# Altium schematic sheet PCB.SchDoc
size A4
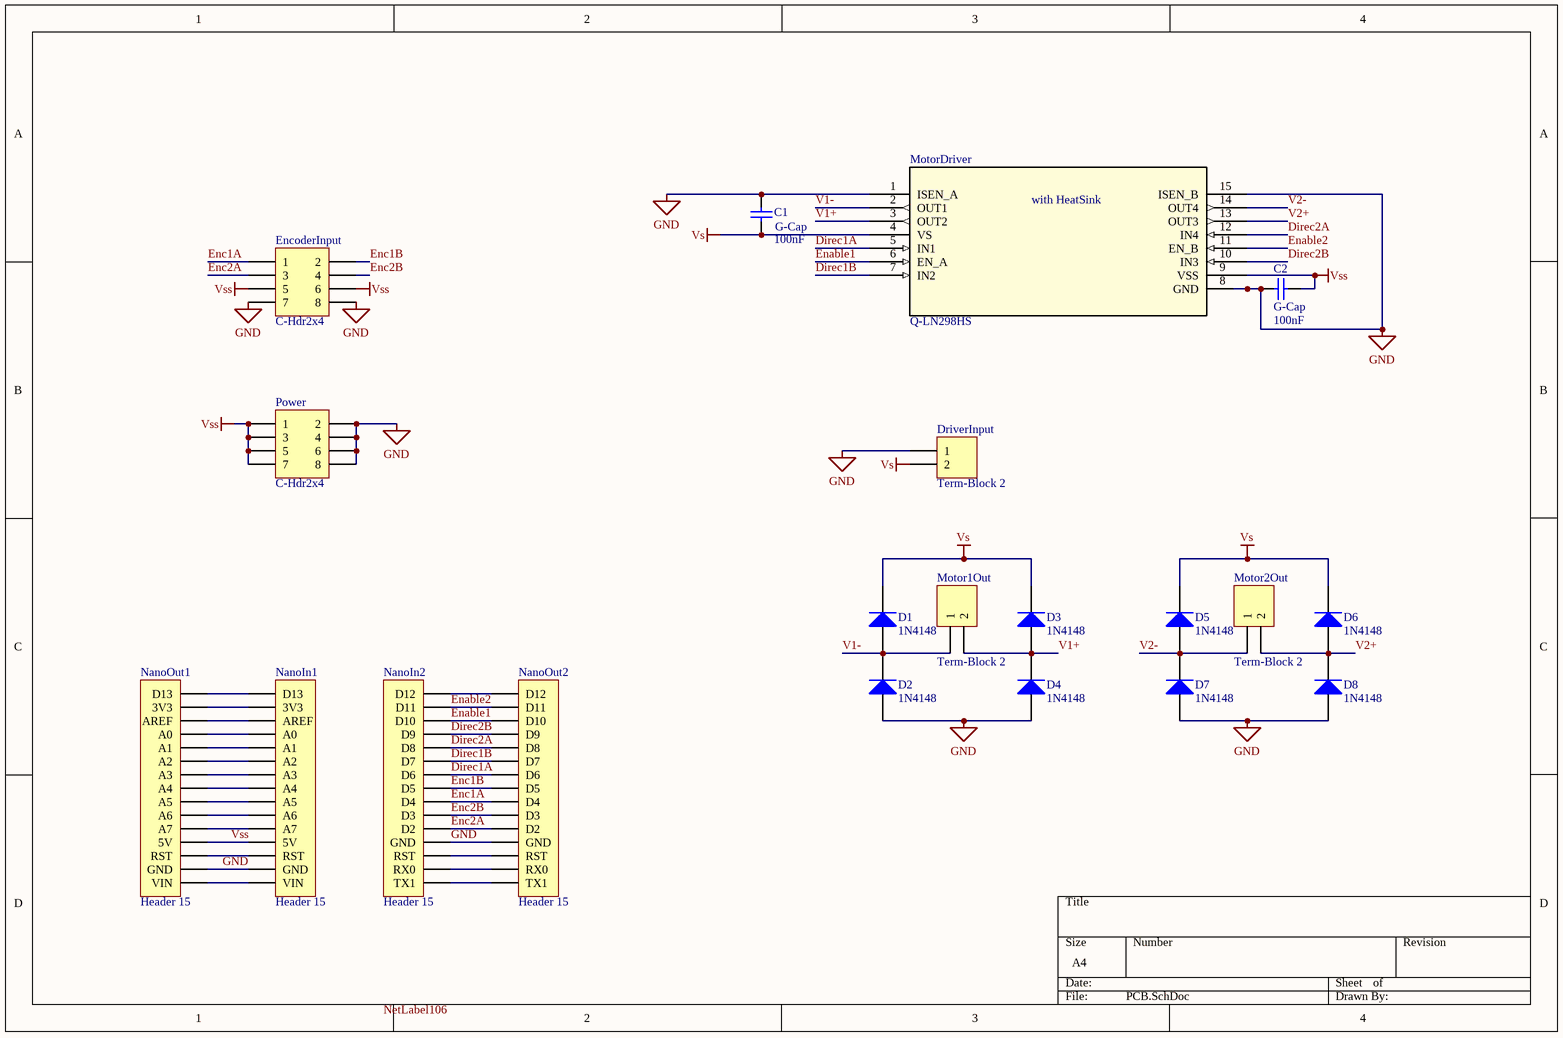
[diagram p0: PCB.SchDoc]

## Parts
C1  G-Cap  value 100nF  [Cap2.54mm_LGE1.0]
C2  G-Cap  value 100nF  [Cap2.54mm_LGE1.0]
D1  1N4148  [DO-41_XLGE1.2]
D2  1N4148  [DO-41_XLGE1.2]
D3  1N4148  [DO-41_XLGE1.2]
D4  1N4148  [DO-41_XLGE1.2]
D5  1N4148  [DO-41_XLGE1.2]
D6  1N4148  [DO-41_XLGE1.2]
D7  1N4148  [DO-41_XLGE1.2]
D8  1N4148  [DO-41_XLGE1.2]
DriverInput  Term-Block 2  [TERM-BLOCK-5.08MM-2POS]
EncoderInput  C-Hdr2x4  [HDR2X4_LGE1.0]
Motor1Out  Term-Block 2  [TERM-BLOCK-5.08MM-2POS]
Motor2Out  Term-Block 2  [TERM-BLOCK-5.08MM-2POS]
MotorDriver  Q-LN298HS  [Multiwatt15_V_ELEC391HS]
NanoIn1  Header 15  [HDR1X15]
NanoIn2  Header 15  [HDR1X15]
NanoOut1  Header 15  [HDR1X15]
NanoOut2  Header 15  [HDR1X15]
Power  C-Hdr2x4  [HDR2X4_LGE1.0]

## Nets
GND: C1.2 C2.1 D2.1(A) D4.1(A) D7.1(A) D8.1(A) DriverInput.1 EncoderInput.7 EncoderInput.8 MotorDriver.1(ISEN_A) MotorDriver.8(GND) MotorDriver.15(ISEN_B) NanoIn1.14(GND) NanoIn2.12(GND) NanoOut1.14(GND) NanoOut2.12(GND) Power.2 Power.4 Power.6 Power.8
Vs: C1.1 D1.2(K) D3.2(K) D5.2(K) D6.2(K) DriverInput.2 MotorDriver.4(VS)
Vss: C2.2 EncoderInput.5 EncoderInput.6 MotorDriver.9(VSS) NanoIn1.12(5V) NanoOut1.12(5V) Power.1 Power.3 Power.5 Power.7
Direc1A: MotorDriver.5(IN1) NanoIn2.7(D6) NanoOut2.7(D6)
Direc1B: MotorDriver.7(IN2) NanoIn2.6(D7) NanoOut2.6(D7)
Direc2A: MotorDriver.12(IN4) NanoIn2.5(D8) NanoOut2.5(D8)
Direc2B: MotorDriver.10(IN3) NanoIn2.4(D9) NanoOut2.4(D9)
Enable1: MotorDriver.6(EN_A) NanoIn2.3(D10) NanoOut2.3(D10)
Enable2: MotorDriver.11(EN_B) NanoIn2.2(D11) NanoOut2.2(D11)
Enc1A: EncoderInput.1 NanoIn2.9(D4) NanoOut2.9(D4)
Enc1B: EncoderInput.2 NanoIn2.8(D5) NanoOut2.8(D5)
Enc2A: EncoderInput.3 NanoIn2.11(D2) NanoOut2.11(D2)
Enc2B: EncoderInput.4 NanoIn2.10(D3) NanoOut2.10(D3)
V1+: D3.1(A) D4.2(K) Motor1Out.2 MotorDriver.3(OUT2)
V1-: D1.1(A) D2.2(K) Motor1Out.1 MotorDriver.2(OUT1)
V2+: D6.1(A) D8.2(K) Motor2Out.2 MotorDriver.13(OUT3)
V2-: D5.1(A) D7.2(K) Motor2Out.1 MotorDriver.14(OUT4)
NetNanoIn1_1: NanoIn1.1(D13) NanoOut1.1(D13)
NetNanoIn1_2: NanoIn1.2(3V3) NanoOut1.2(3V3)
NetNanoIn1_3: NanoIn1.3(AREF) NanoOut1.3(AREF)
NetNanoIn1_4: NanoIn1.4(A0) NanoOut1.4(A0)
NetNanoIn1_5: NanoIn1.5(A1) NanoOut1.5(A1)
NetNanoIn1_6: NanoIn1.6(A2) NanoOut1.6(A2)
NetNanoIn1_7: NanoIn1.7(A3) NanoOut1.7(A3)
NetNanoIn1_8: NanoIn1.8(A4) NanoOut1.8(A4)
NetNanoIn1_9: NanoIn1.9(A5) NanoOut1.9(A5)
NetNanoIn1_10: NanoIn1.10(A6) NanoOut1.10(A6)
NetNanoIn1_11: NanoIn1.11(A7) NanoOut1.11(A7)
NetNanoIn1_13: NanoIn1.13(RST) NanoOut1.13(RST)
NetNanoIn1_15: NanoIn1.15(VIN) NanoOut1.15(VIN)
NetNanoIn2_1: NanoIn2.1(D12) NanoOut2.1(D12)
NetNanoIn2_13: NanoIn2.13(RST) NanoOut2.13(RST)
NetNanoIn2_14: NanoIn2.14(RX0) NanoOut2.14(RX0)
NetNanoIn2_15: NanoIn2.15(TX1) NanoOut2.15(TX1)

## Notes on the sheet
- Labels drawn without touching a wire or pin: NetLabel106
- (in symbol Q-LN298HS) with HeatSink

## Library data of the parts
C1 C2 = G-Cap: Capacitor (specify value); Published: 8-Jun-2000; LatestRevisionDate: 17-Jul-2002; LatestRevisionNote: Re-released for DXP Platform.; PackageReference: RAD-0.3; Publisher: Altium Limited
D1-D8 = T-DiodeRect: High-speed Diode; ComponentLink1URL: http://www.mccsemi.com/up_pdf/1N4148(DO-35).pdf; ComponentLink1Description: Datasheet (ELEC391)
DriverInput Motor1Out Motor2Out = C-Block2: Terminal-Block 1x2; LatestRevisionDate: 17-Jul-2002; LatestRevisionNote: Re-released for DXP Platform.; Publisher: Altium Limited
EncoderInput Power = C-Hdr2x4: Header, 4-Pin, Dual row; LatestRevisionDate: 17-Jul-2002; LatestRevisionNote: Re-released for DXP Platform.; Publisher: Altium Limited
MotorDriver = Q-LN298HS: LN298 - IC Bridge Driver Par 15Multiwatt; Manufacturer_Part_Number: L298N; Vendor: ST Microelectronics; Input Type: Non-Inverting; Number of Outputs: 4; Current - Output / Channel: 2A; Current - Peak Output: 3A; Voltage - Supply: 4.5 V ~ 46 V; C: Copyright (C) 2015 Accelerated Designs. All rights reserved; Quantity_Available: 5651; DataSheet: http://www.st.com/internet/com/TECHNICAL_RESOURCES/TECHNICAL_LITERATURE/DATASHEET/CD00000240.pdf; Type: Type; On-State Resistance: -; Operating Temperature: -25Â°C ~ 130Â°C; Mounting Type: Through Hole; Package / Case: Multiwatt-15 (Vertical, Bent and Staggered Leads); Supplier Device Package: 15-Multiwatt; Packaging: Tube; Copyright: Copyright (C) 2015 Accelerated Designs. All rights reserved; RefDes: RefDes; Value: Value; ComponentLink1URL: http://www.st.com/content/ccc/resource/technical/document/datasheet/82/cc/3f/39/0a/29/4d/f0/CD00000240.pdf/files/CD00000240.pdf/jcr:content/translations/en.CD00000240.pdf; ComponentLink1Description: Datasheet (ELEC391)
NanoIn1 NanoIn2 NanoOut1 NanoOut2 = Header 15: Header, 15-Pin; LatestRevisionDate: 17-Jul-2002; LatestRevisionNote: Re-released for DXP Platform.; Publisher: Altium Limited